# EAGLE schematic amplifier (EAGLE 9.6.2)
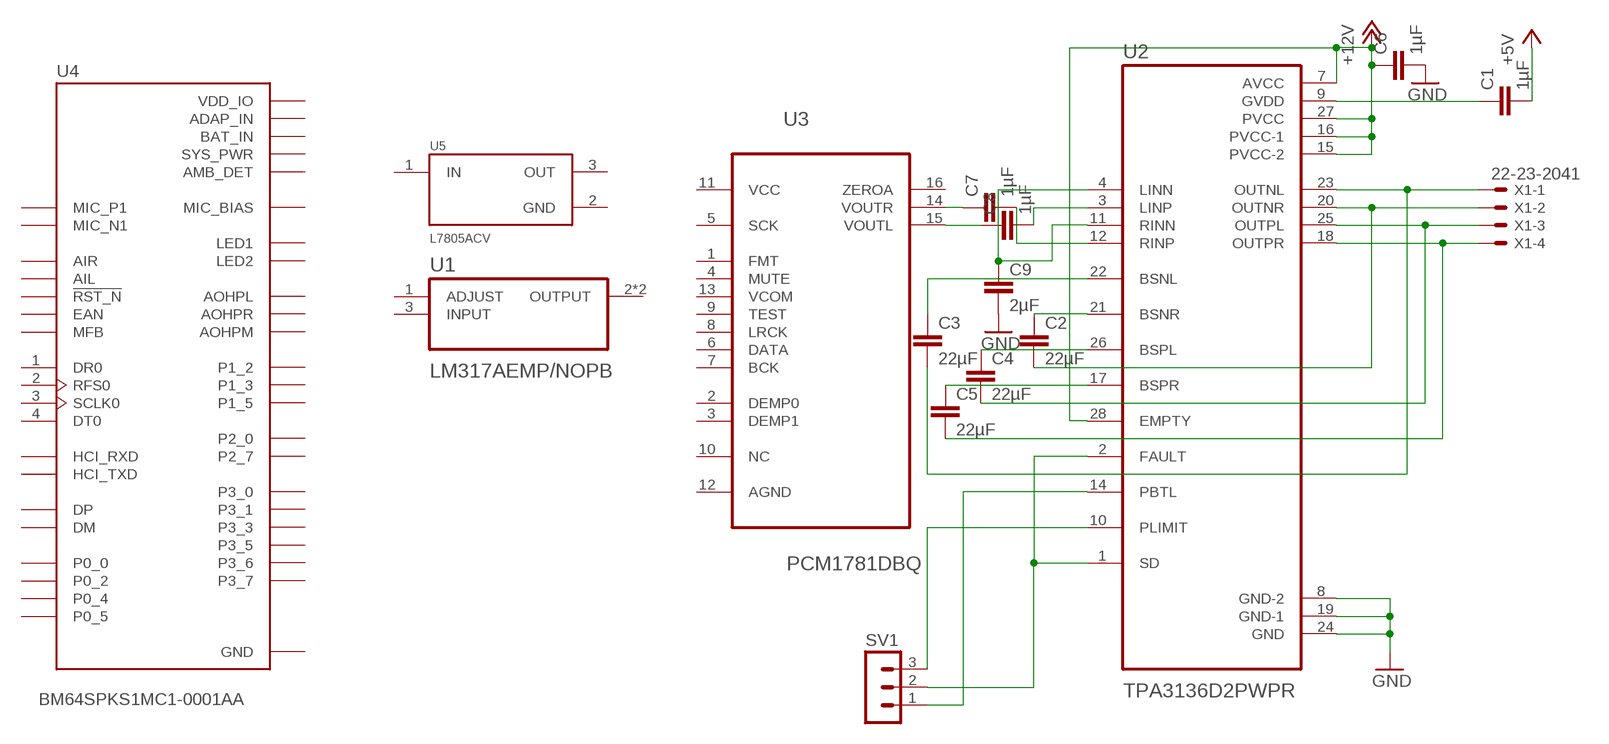
[diagram p0: schematic, sheet 1]

## Parts
C1  1µF  C-EU025-025X050  [C025-025X050]
C2  22µF  C-EU025-025X050  [C025-025X050]
C3  22µF  C-EU025-025X050  [C025-025X050]
C4  22µF  C-EU025-025X050  [C025-025X050]
C5  22µF  C-EU025-025X050  [C025-025X050]
C6  1µF  C-EU025-025X050  [C025-025X050]
C7  1µF  C-EU025-025X050  [C025-025X050]
C8  1µF  C-EU025-025X050  [C025-025X050]
C9  2µF  C-EU025-025X050  [C025-025X050]
SV1  MA03-1  [MA03-1]
U1  LM317AEMP/NOPB  [SOT230P700X180-4N]
U2  TPA3136D2PWPR  [IC_TPS61196PWPRQ1]
U3  PCM1781DBQ  [SOP63P600X175-16N]
U4  BM64SPKS1MC1-0001AA  [MODULE_BM64SPKS1MC1-0001AA]
U5  L7805ACV  [TO254P460X1020X1945-3P]
X1  22-23-2041  [22-23-2041]

## Nets
+5V: C1.2
+12V: C6.1 U2.7(AVCC) U2.15(PVCC-2) U2.16(PVCC-1) U2.27(PVCC) U2.28(EMPTY)
GND: C6.2 C9.2 U2.8(GND-2) U2.19(GND-1) U2.24(GND)
N$1: C7.2 U2.12(RINP)
N$2: C8.2 U2.3(LINP)
N$3: SV1.3 U2.10(PLIMIT)
N$4: C3.2 U2.23(OUTNL) X1.1
N$5: C2.2 U2.20(OUTNR) X1.2
N$6: C4.2 U2.25(OUTPL) X1.3
N$7: C5.2 U2.18(OUTPR) X1.4
N$8: SV1.2 U2.1(SD) U2.2(FAULT)
N$9: SV1.1 U2.14(PBTL)
N$10: C2.1 U2.21(BSNR)
N$11: C4.1 U2.26(BSPL)
N$12: C5.1 U2.17(BSPR)
N$13: C3.1 U2.22(BSNL)
N$14: C1.1 U2.9(GVDD)
N$15: C7.1 U3.14(VOUTR)
N$16: C8.1 U3.15(VOUTL)
N$17: C9.1 U2.4(LINN) U2.11(RINN)
Unconnected: U1.1(ADJUST) U1.2(OUTPUT) U1.3(INPUT) U1.4(OUTPUT) U3.1(FMT) U3.2(DEMP0) U3.3(DEMP1) U3.4(MUTE) U3.5(SCK) U3.6(DATA) U3.7(BCK) U3.8(LRCK) U3.9(TEST) U3.10(NC) U3.12(AGND) U3.13(VCOM) U3.16(ZEROA) U4.1(DR0) U4.2(RFS0) U4.3(SCLK0) U4.4(DT0) U4.5(AOHPR) U4.6(AOHPM) U4.7(AOHPL) U4.8(MIC_N1) U4.9(MIC_P1) U4.11(AIR) U4.12(AIL) U4.13(!RST_N) U4.15(P1_2) U4.16(P1_3) U4.17(P0_4) U4.18(P1_5) U4.19(HCI_RXD) U4.20(HCI_TXD) U4.26(MFB) U4.27(LED2) U4.28(LED1) U4.29(P3_7) U4.30(P3_5) U4.31(P0_0) U4.32(EAN) U4.33(DM) U4.34(DP) U4.35(P0_5) U4.36(P3_0) U4.37(P3_1) U4.38(P3_3) U4.39(P3_6) U4.40(P0_2) U4.41(P2_0) U4.42(P2_7) U5.1(IN) U5.3(OUT)

## Power pins joined to a net without a drawn wire
ADAP_IN: U4.23(ADAP_IN)
AMB_DET: U4.25(AMB_DET)
BAT_IN: U4.22(BAT_IN)
GND: U4.14(GND) U4.43(GND) U5.2(GND)
MIC_BIAS: U4.10(MIC_BIAS)
SYS_PWR: U4.24(SYS_PWR)
VCC: U3.11(VCC)
VDD_IO: U4.21(VDD_IO)

## Library data of the parts
C1-C9 = rcl:C-EU: CAPACITOR, European symbol; SPICEPREFIX: C
SV1 = con-lstb:MA03-1: PIN HEADER; OC_FARNELL: unknown; OC_NEWARK: unknown
U1 = LM317AEMP_NOPB:LM317AEMP/NOPB: Check prices <https://pricing.snapeda.com/parts/LM317AEMP/NOPB/Texas%20Instruments/view-part?ref=eda>; AVAILABILITY: Good; DESCRIPTION: 1.5-A, 40-V, adjustable linear voltage regulator with high-accuracy 4-SOT-223 -40 to 125; MF: Texas Instruments; MP: LM317AEMP/NOPB; PACKAGE: SOT-223-4 Texas Instruments; PRICE: None; PURCHASE-URL: https://pricing.snapeda.com/search/part/LM317AEMP/NOPB/?ref=eda
U2 = TPA3136D2PWPR:TPA3136D2PWPR: Check prices <https://pricing.snapeda.com/parts/TPA3136D2PWPR/Texas%20Instruments/view-part?ref=eda>; AVAILABILITY: Warning; DESCRIPTION: 10-W stereo, 20-W mono, 4.5- to 14.4-V, analog in Class-D audio amplifier w/ inductor free & low EMI 28-HTSSOP -40 to 85; MF: Texas Instruments; MP: TPA3136D2PWPR; PACKAGE: HTSSOP-28 Texas Instruments; PRICE: None; PURCHASE-URL: https://pricing.snapeda.com/search/part/TPA3136D2PWPR/?ref=eda
U3 = PCM1781DBQ:PCM1781DBQ: ANALOG-TO-DIGITAL CONVERTER Check prices <https://pricing.snapeda.com/parts/PCM1781DBQ/Texas%20Instruments/view-part?ref=eda>; AVAILABILITY: Warning; DESCRIPTION: 106dB SNR Stereo DAC (H/W Control) 16-SSOP -25 to 85; MF: Texas Instruments; MP: PCM1781DBQ; PACKAGE: SSOP-16 Texas Instruments; PRICE: None; PURCHASE-URL: https://pricing.snapeda.com/search/part/PCM1781DBQ/?ref=eda
U4 = BM64SPKS1MC1-0001AA:BM64SPKS1MC1-0001AA: Bt4.2 Stereo Audio With Ble, I2s, Flash, Class-1, With Shield, Built-In Antenna 43 Module 32x15x2.5 Mm Tray Check prices <https://pricing.snapeda.com/parts/BM64SPKS1MC1-0001AA/Microchip/view-part?ref=eda>; AVAILABILITY: Warning; DESCRIPTION: Bluetooth Bluetooth v5.0 Transceiver Module 2.4GHz Integrated, Trace Surface Mount; MF: Microchip; MP: BM64SPKS1MC1-0001AA; PACKAGE: Module Microchip; PRICE: None; PURCHASE-URL: https://pricing.snapeda.com/search/part/BM64SPKS1MC1-0001AA/?ref=eda
U5 = L7805ACV:L7805ACV: L7805 Series 1.5 A 5 V Three Terminal Voltage Regulator - TO-220 Check prices <https://pricing.snapeda.com/parts/L7805ACV/STMicroelectronics/view-part?ref=eda>; AVAILABILITY: Good; DESCRIPTION: Linear Voltage Regulator IC Positive Fixed 1 Output 1.5A TO-220; MF: STMicroelectronics; MP: L7805ACV; PACKAGE: TO-220-3 ON Semiconductor; PRICE: None; PURCHASE-URL: https://pricing.snapeda.com/search/part/L7805ACV/?ref=eda
X1 = con-molex:22-23-2041: .100" (2.54mm) Center Header - 4 Pin; MF: MOLEX; MPN: 22-23-2041; OC_FARNELL: 1462920; OC_NEWARK: 38C0355